# Altium schematic sheet IMU.SchDoc
size A4; SheetNumber: 3; SheetTotal: 3
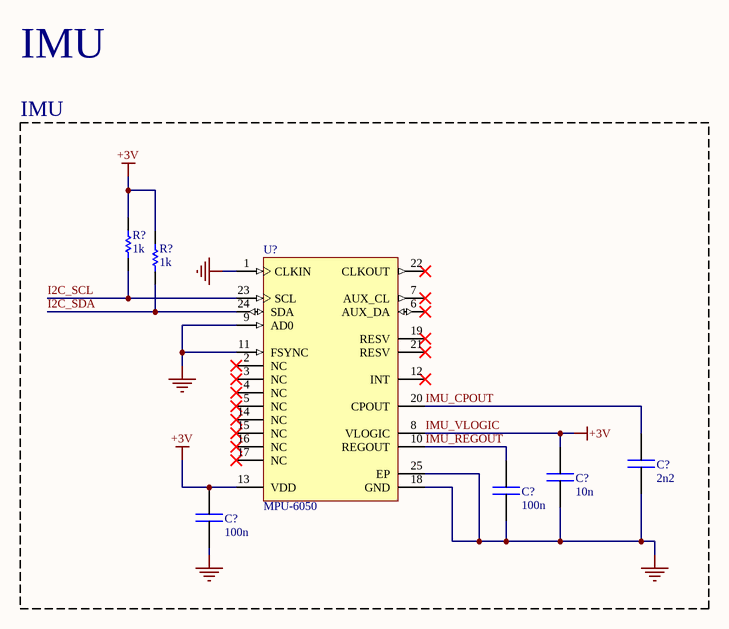
[diagram p0: IMU.SchDoc]

## Parts
(Parts that share a designator on the sheet are numbered #1, #2 ... from top to bottom, then left to right.)
C?#1  2n2
C?#2  10n
C?#3  100n
C?#4  100n
R?#1  1k  [RESC1608X55X25LL10T15]
R?#2  1k  [RESC1608X55X25LL10T15]
U?  MPU-6050  [IS-QFN-24_V]

## Blocks framed on the sheet
IMU: C?#1-C?#4 R?#1 R?#2 U?

## Nets
GND: C?#1.2 C?#2.2 C?#3.2 C?#4.2 U?.1(CLKIN) U?.9(AD0) U?.11(FSYNC) U?.18(GND) U?.25(EP)
IMU_VLOGIC: C?#2.1 C?#4.1 R?#1.2 R?#2.2 U?.8(VLOGIC) U?.13(VDD)  [also labelled +3V]
I2C_SCL: R?#1.1 U?.23(SCL)
I2C_SDA: R?#2.1 U?.24(SDA)
IMU_CPOUT: C?#1.1 U?.20(CPOUT)
IMU_REGOUT: C?#3.1 U?.10(REGOUT)

Not connected (* = marked no-connect by the designer): U? 2(NC)* 3(NC)* 4(NC)* 5(NC)* 6(AUX_DA)* 7(AUX_CL)* 12(INT)* 14(NC)* 15(NC)* 16(NC)* 17(NC)* 19(RESV)* 21(RESV)* 22(CLKOUT)*

## Notes on the sheet
- IMU

## Library data of the parts
C?#1 = CAP_2.2nF_0603: 2200 pF ±20% 50V Ceramic Capacitor X7R 0603 (1608 Metric); Supplier 1: Mouser; Supplier Part Number 1: 81-GCD188R71H222MA1D
C?#2 = CAP_10nF_0603: CAP CER 10000PF 100V X7R 0603; Supplier 1: Arrow Electronics; Supplier Part Number 1: GCM188R72A103KA37J
C?#3 C?#4 = CAP_0.1uF_0603: CAP CER 0.1UF 50V X7R 0603; Supplier 1: Mouser; Supplier Part Number 1: 81-GCM188R71H104JA7D
R?#1 R?#2 = CMP-2000-04305-1: Manufacturer: Yageo; Part Number: RC0603JR-101KL
U? = CMP-1753-00002-2: 3-Axis Gyroscope, Accelerometer and a Digital Motion Processor(TM) (DMP), 2.375 to 3.46 V, -40 to 85 degC, 24-Pin QFN, RoHS, Tape and Reel; Manufacturer: InvenSense; Featured Product: MPU-60506-Axis,IntegratedI²CSolution; Other Names: 1428-1007-2 / MPU6050; Sensor Type: MotionTracking; Online Catalog: MPU-6000™Series; Unit PriceUSD: Digital; Datasheet Version: Rev. 3.3, 05/2012; Category: Sensors,Transducers; Datasheet URL: http://datasheet.octopart.com/MPU-6050-InvenSense-datasheet-14421344.pdf; Family: Multifunction; Standard Package: 5,000; Manufacturer URL: http://www.invensense.com/; Output Type: Digital; Dynamic Catalog: MPU-6000™Series